# Altium schematic sheet PE0024.SchDoc
size 558 x 431 mm; SheetNumber: 1; SheetTotal: 1; SPICEModelCacheSWXRTNLW: <root> / <DocumentId>SWXRTNLW</DocumentId> / <CacheFrame Number="0"> / <Model Name="cap" Kind="MDL"> / <Text>*Default semiconductor capacitor / .MODEL CAP C()</Text> / </Model> / </CacheFrame> / </root>
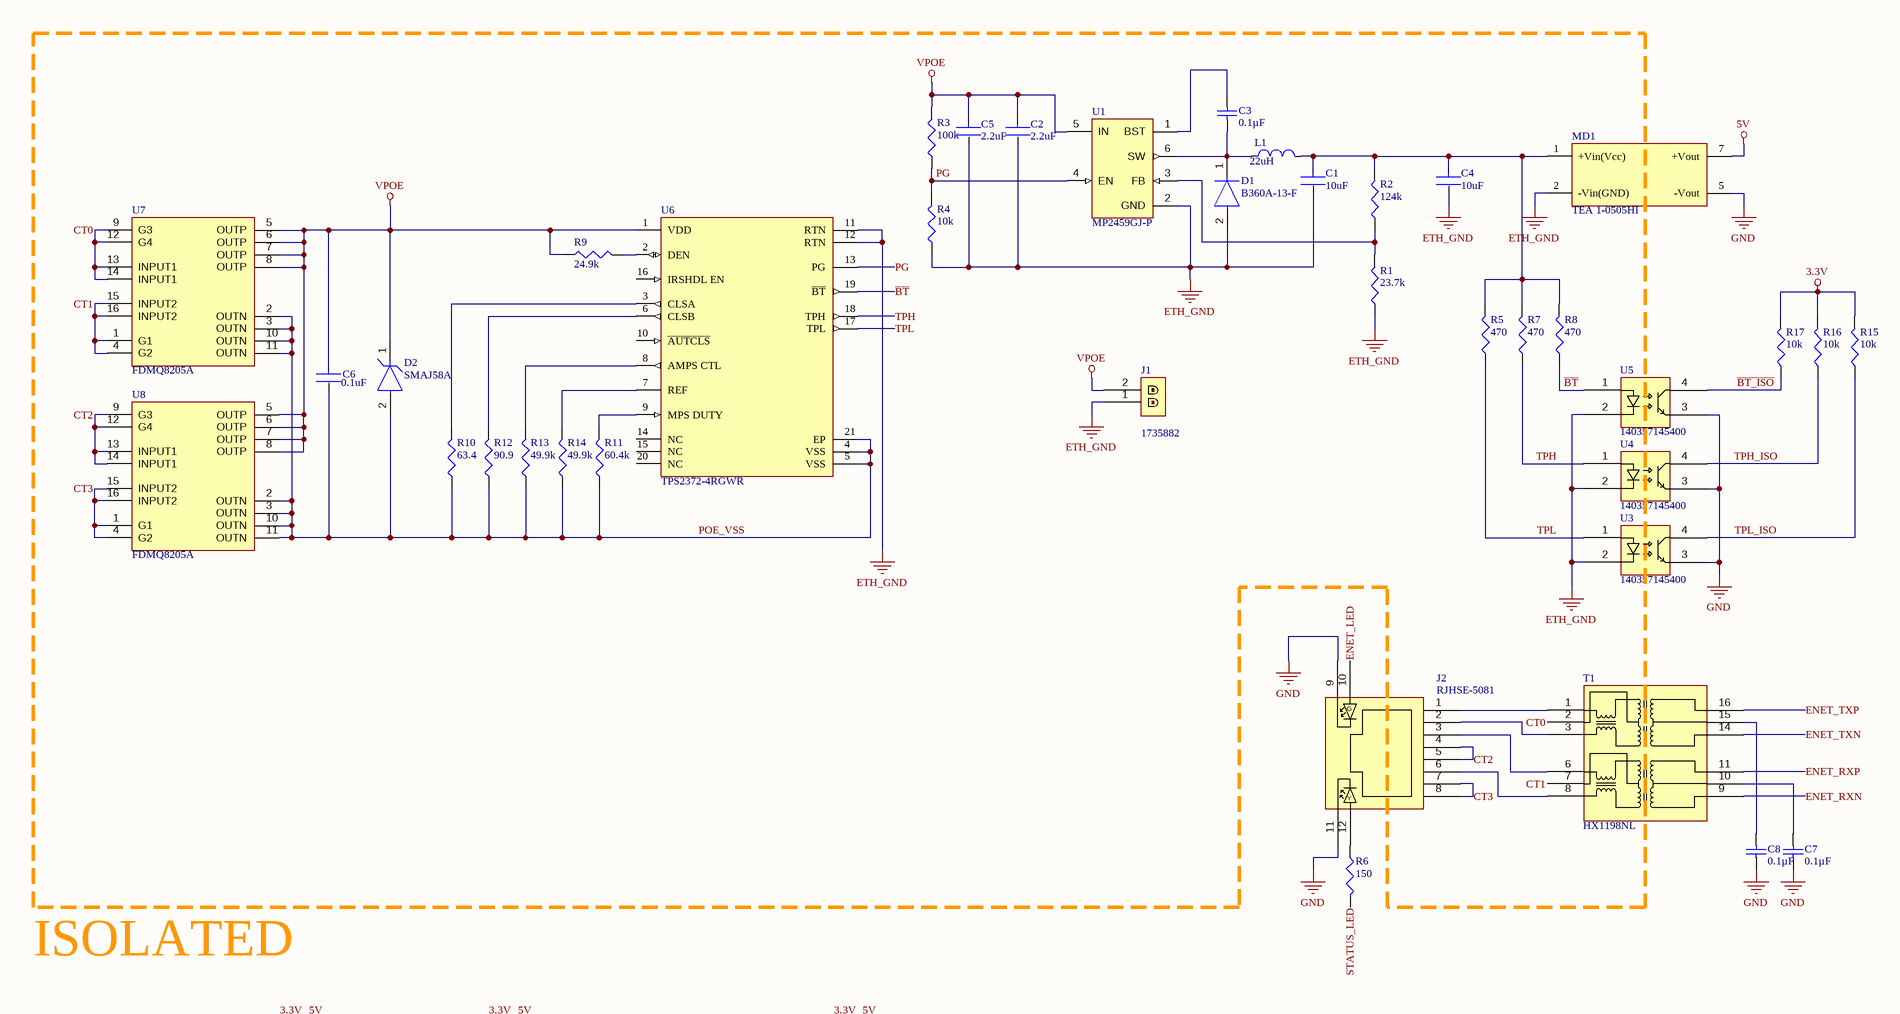
[diagram p0: PE0024.SchDoc, top left]
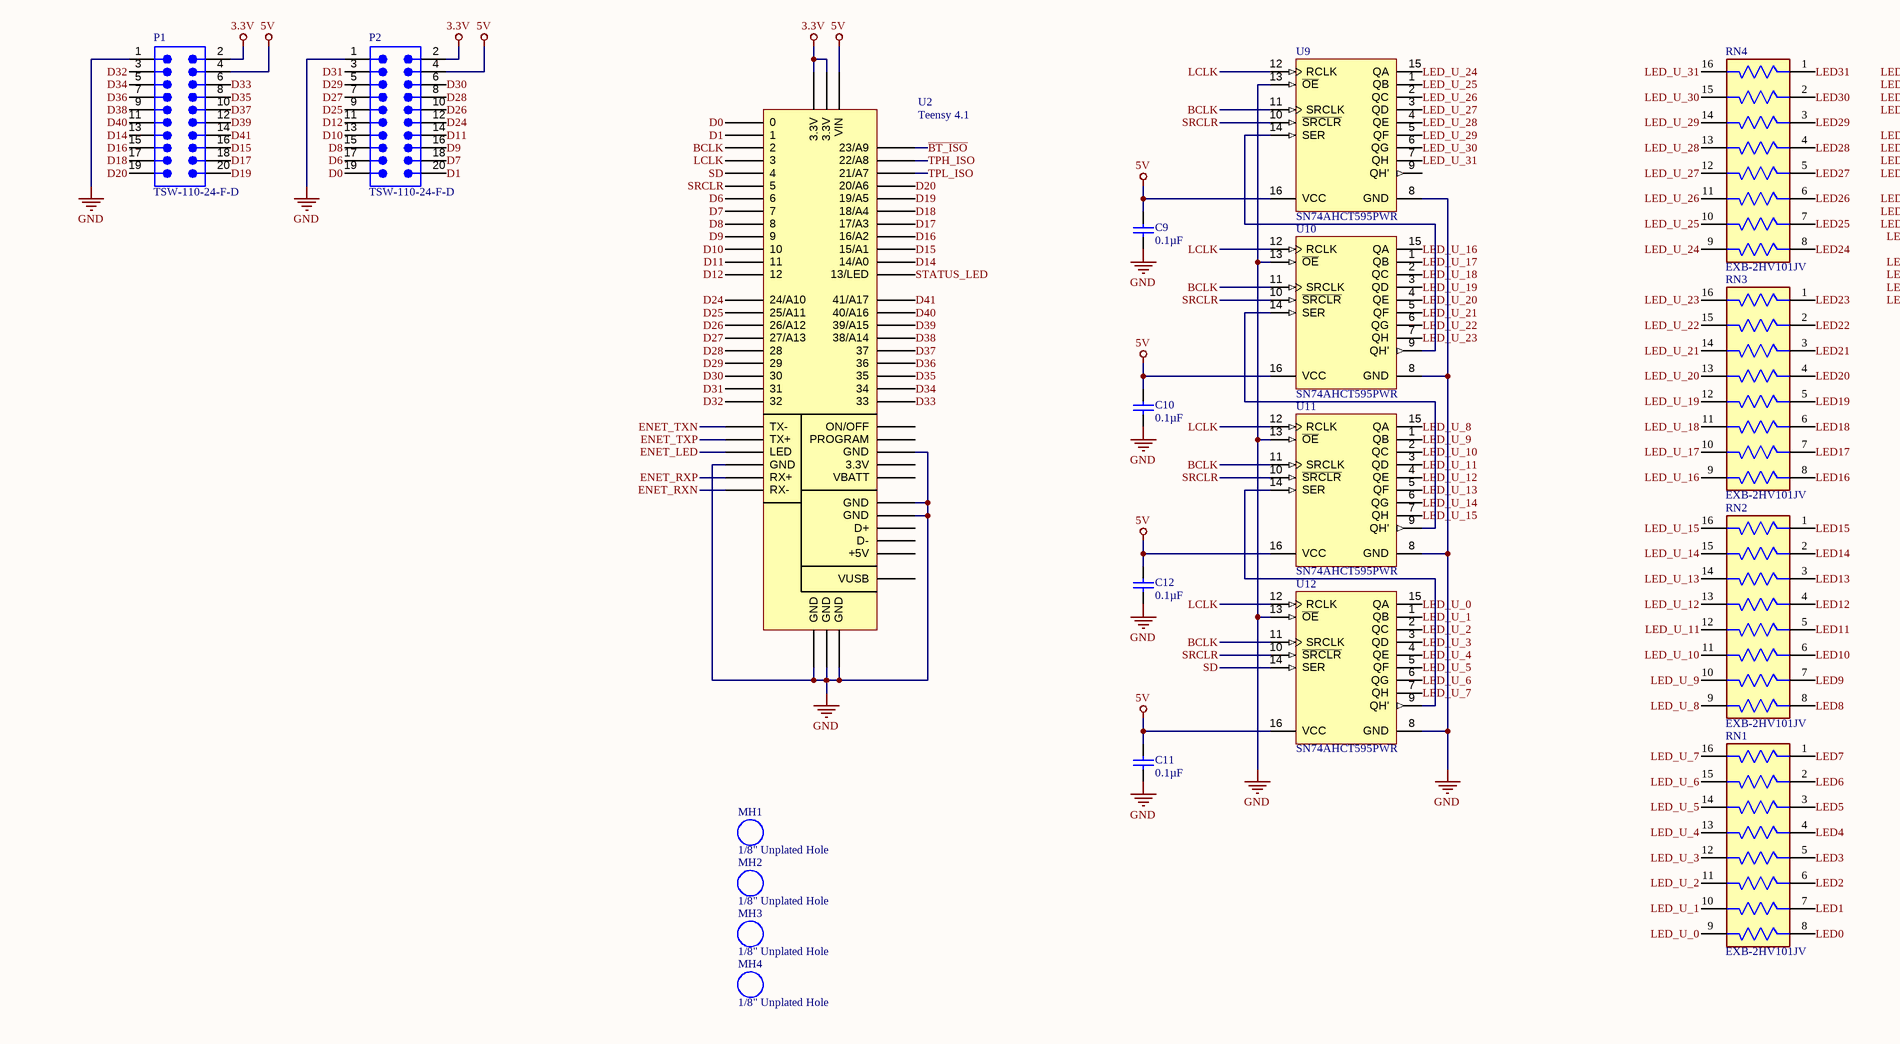
[diagram p1: PE0024.SchDoc, bottom left]
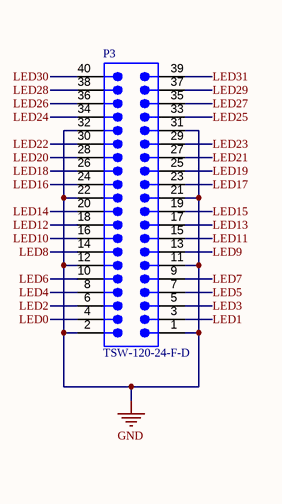
[diagram p2: PE0024.SchDoc, bottom right]

## Parts
C1  Capacitance: 10uF  [FP-GRM21B-0_1-IPC_C]  (hidden comment: GRM21BR61C106KE15L)
C2  Capacitance: 2.2uF  [FP-C3216-160-0_2-IPC_B]  (hidden comment: C3216X7S2A225K160AB)
C3  value 0.1µF  [0402CAP]  (hidden comment: Cap)
C4  Capacitance: 10uF  [FP-GRM21B-0_1-IPC_C]  (hidden comment: GRM21BR61C106KE15L)
C5  Capacitance: 2.2uF  [FP-C3216-160-0_2-IPC_B]  (hidden comment: C3216X7S2A225K160AB)
C6  Capacitance: 0.1uF  [FP-GRM188-0_1-e0_2_0_5-IPC_B]  (hidden comment: GRM188R72A104KA35D)
C7  value 0.1µF  [0402CAP]  (hidden comment: Cap)
C8  value 0.1µF  [0402CAP]  (hidden comment: Cap)
C9  value 0.1µF  [0402CAP]  (hidden comment: Cap)
C10  value 0.1µF  [0402CAP]  (hidden comment: Cap)
C11  value 0.1µF  [0402CAP]  (hidden comment: Cap)
C12  value 0.1µF  [0402CAP]  (hidden comment: Cap)
D1  B360A-13-F  [FP-SMA-MFG]
D2  SMAJ58A  [FP-SMAJ-MFG]
J1  1735882  [MSTBW 2,5/2-G-5,08]
J2  RJHSE-5081  [RJHSE-5081]
L1  Inductance: 22uH  [FP-NR6028-MFG]  (hidden comment: NRS6028T220MMGJ)
MD1  TEA 1-0505HI  [FP-TEA_1HI-MFG]
MH1  1/8" Unplated Hole  [1/8" Unplated Hole]
MH2  1/8" Unplated Hole  [1/8" Unplated Hole]
MH3  1/8" Unplated Hole  [1/8" Unplated Hole]
MH4  1/8" Unplated Hole  [1/8" Unplated Hole]
P1  TSW-110-24-F-D  [SMTC-TSW-110-24-X-D]
P2  TSW-110-24-F-D  [SMTC-TSW-110-24-X-D]
P3  TSW-120-24-F-D  [SMTC-TSW-120-24-X-D]
R1  value 23.7k  [0402RES]  (hidden comment: Res)
R2  value 124k  [0402RES]  (hidden comment: Res)
R3  value 100k  [0402RES]  (hidden comment: Res)
R4  value 10k  [0402RES]  (hidden comment: Res)
R5  value 470  [0402RES]  (hidden comment: Res)
R6  value 150  [0402RES]  (hidden comment: Res)
R7  value 470  [0402RES]  (hidden comment: Res)
R8  value 470  [0402RES]  (hidden comment: Res)
R9  value 24.9k  [0402RES]  (hidden comment: Res)
R10  value 63.4  [0402RES]  (hidden comment: Res)
R11  value 60.4k  [0402RES]  (hidden comment: Res)
R12  value 90.9  [0402RES]  (hidden comment: Res)
R13  value 49.9k  [0402RES]  (hidden comment: Res)
R14  value 49.9k  [0402RES]  (hidden comment: Res)
R15  value 10k  [0402RES]  (hidden comment: Res)
R16  value 10k  [0402RES]  (hidden comment: Res)
R17  value 10k  [0402RES]  (hidden comment: Res)
RN1  EXB-2HV101JV  [FP-EXB2HV-MFG]
RN2  EXB-2HV101JV  [FP-EXB2HV-MFG]
RN3  EXB-2HV101JV  [FP-EXB2HV-MFG]
RN4  EXB-2HV101JV  [FP-EXB2HV-MFG]
T1  HX1198NL  [HX1198NL]
U1  MP2459GJ-P  [FP-MP2459GJ-P-MFG]
U2  Teensy 4.1  [Teensy_4.1]
U3  140357145400  [SOP254P700X210-4N]
U4  140357145400  [SOP254P700X210-4N]
U5  140357145400  [SOP254P700X210-4N]
U6  TPS2372-4RGWR  [FP-RGW0020B-MFG]
U7  FDMQ8205A  [FP-511CS-MFG]
U8  FDMQ8205A  [FP-511CS-MFG]
U9  SN74AHCT595PWR  [PW0016A_M]
U10  SN74AHCT595PWR  [PW0016A_M]
U11  SN74AHCT595PWR  [PW0016A_M]
U12  SN74AHCT595PWR  [PW0016A_M]

## Nets
3.3V: P1.2 P2.2 R15.2 R16.2 R17.2 U2.15(3.3V) U2.46(3.3V)
5V: C9.2 C10.2 C11.2 C12.2 MD1.7(+Vout) P1.4 P2.4 U2.48(VIN) U9.16(VCC) U10.16(VCC) U11.16(VCC) U12.16(VCC)
ETH_GND: C1.2 C2.2 C4.2 C5.2 D1.2(A) J1.1 MD1.2(-Vin(GND)) R1.1 R4.1 U1.2(GND) U3.2 U4.2 U5.2 U6.11(RTN) U6.12(RTN)
GND: C7.1 C8.1 C9.1 C10.1 C11.1 C12.1 J2.9 J2.11 MD1.5(-Vout) P1.1 P2.1 P3.1 P3.2 P3.11 P3.12 P3.21 P3.22 P3.31 P3.32 U2.1(GND) U2.34(GND) U2.47(GND) U2.51(GND) U2.57(GND) U2.58(GND) U2.63(GND) U3.3 U4.3 U5.3 U9.8(GND) U9.13(~{OE}) U10.8(GND) U10.13(~{OE}) U11.8(GND) U11.13(~{OE}) U12.8(GND) U12.13(~{OE})
VPOE: C2.1 C5.1 C6.1 D2.1(C) J1.2 R3.2 R9.1 U1.5(IN) U6.1(VDD) U7.5(OUTP) U7.6(OUTP) U7.7(OUTP) U7.8(OUTP) U8.5(OUTP) U8.6(OUTP) U8.7(OUTP) U8.8(OUTP)
~{BT}: R8.1 U5.1 U6.19(~{BT})
~{BT_ISO}: R17.1 U2.45(23/A9) U5.4
BCLK: U2.4(2) U9.11(SRCLK) U10.11(SRCLK) U11.11(SRCLK) U12.11(SRCLK)
CT0: T1.2 U7.9(G3) U7.12(G4) U7.13(INPUT1) U7.14(INPUT1)
CT1: T1.7 U7.1(G1) U7.4(G2) U7.15(INPUT2) U7.16(INPUT2)
CT2: J2.4 J2.5 U8.9(G3) U8.12(G4) U8.13(INPUT1) U8.14(INPUT1)
CT3: J2.7 J2.8 U8.1(G1) U8.4(G2) U8.15(INPUT2) U8.16(INPUT2)
D0: P2.19 U2.2(0)
D1: P2.20 U2.3(1)
D6: P2.17 U2.8(6)
D7: P2.18 U2.9(7)
D8: P2.15 U2.10(8)
D9: P2.16 U2.11(9)
D10: P2.13 U2.12(10)
D11: P2.14 U2.13(11)
D12: P2.11 U2.14(12)
D14: P1.13 U2.36(14/A0)
D15: P1.16 U2.37(15/A1)
D16: P1.15 U2.38(16/A2)
D17: P1.18 U2.39(17/A3)
D18: P1.17 U2.40(18/A4)
D19: P1.20 U2.41(19/A5)
D20: P1.19 U2.42(20/A6)
D24: P2.12 U2.16(24/A10)
D25: P2.9 U2.17(25/A11)
D26: P2.10 U2.18(26/A12)
D27: P2.7 U2.19(27/A13)
D28: P2.8 U2.20(28)
D29: P2.5 U2.21(29)
D30: P2.6 U2.22(30)
D31: P2.3 U2.23(31)
D32: P1.3 U2.24(32)
D33: P1.6 U2.25(33)
D34: P1.5 U2.26(34)
D35: P1.8 U2.27(35)
D36: P1.7 U2.28(36)
D37: P1.10 U2.29(37)
D38: P1.9 U2.30(38/A14)
D39: P1.12 U2.31(39/A15)
D40: P1.11 U2.32(40/A16)
D41: P1.14 U2.33(41/A17)
ENET_LED: J2.10 U2.62(LED)
ENET_RXN: T1.9 U2.65(RX-)
ENET_RXP: T1.11 U2.64(RX+)
ENET_TXN: T1.14 U2.60(TX-)
ENET_TXP: T1.16 U2.61(TX+)
LCLK: U2.5(3) U9.12(RCLK) U10.12(RCLK) U11.12(RCLK) U12.12(RCLK)
LED0: P3.4 RN1.8
LED1: P3.3 RN1.7
LED2: P3.6 RN1.6
LED3: P3.5 RN1.5
LED4: P3.8 RN1.4
LED5: P3.7 RN1.3
LED6: P3.10 RN1.2
LED7: P3.9 RN1.1
LED8: P3.14 RN2.8
LED9: P3.13 RN2.7
LED10: P3.16 RN2.6
LED11: P3.15 RN2.5
LED12: P3.18 RN2.4
LED13: P3.17 RN2.3
LED14: P3.20 RN2.2
LED15: P3.19 RN2.1
LED16: P3.24 RN3.8
LED17: P3.23 RN3.7
LED18: P3.26 RN3.6
LED19: P3.25 RN3.5
LED20: P3.28 RN3.4
LED21: P3.27 RN3.3
LED22: P3.30 RN3.2
LED23: P3.29 RN3.1
LED24: P3.34 RN4.8
LED25: P3.33 RN4.7
LED26: P3.36 RN4.6
LED27: P3.35 RN4.5
LED28: P3.38 RN4.4
LED29: P3.37 RN4.3
LED30: P3.40 RN4.2
LED31: P3.39 RN4.1
LED_U_0: RN1.9 U12.15(QA)
LED_U_1: RN1.10 U12.1(QB)
LED_U_2: RN1.11 U12.2(QC)
LED_U_3: RN1.12 U12.3(QD)
LED_U_4: RN1.13 U12.4(QE)
LED_U_5: RN1.14 U12.5(QF)
LED_U_6: RN1.15 U12.6(QG)
LED_U_7: RN1.16 U12.7(QH)
LED_U_8: RN2.9 U11.15(QA)
LED_U_9: RN2.10 U11.1(QB)
LED_U_10: RN2.11 U11.2(QC)
LED_U_11: RN2.12 U11.3(QD)
LED_U_12: RN2.13 U11.4(QE)
LED_U_13: RN2.14 U11.5(QF)
LED_U_14: RN2.15 U11.6(QG)
LED_U_15: RN2.16 U11.7(QH)
LED_U_16: RN3.9 U10.15(QA)
LED_U_17: RN3.10 U10.1(QB)
LED_U_18: RN3.11 U10.2(QC)
LED_U_19: RN3.12 U10.3(QD)
LED_U_20: RN3.13 U10.4(QE)
LED_U_21: RN3.14 U10.5(QF)
LED_U_22: RN3.15 U10.6(QG)
LED_U_23: RN3.16 U10.7(QH)
LED_U_24: RN4.9 U9.15(QA)
LED_U_25: RN4.10 U9.1(QB)
LED_U_26: RN4.11 U9.2(QC)
LED_U_27: RN4.12 U9.3(QD)
LED_U_28: RN4.13 U9.4(QE)
LED_U_29: RN4.14 U9.5(QF)
LED_U_30: RN4.15 U9.6(QG)
LED_U_31: RN4.16 U9.7(QH)
PG: R3.1 R4.2 U1.4(EN) U6.13(PG)
POE_VSS: C6.2 D2.2(A) R10.1 R11.1 R12.1 R13.1 R14.1 U6.4(VSS) U6.5(VSS) U6.21(EP) U7.2(OUTN) U7.3(OUTN) U7.10(OUTN) U7.11(OUTN) U8.2(OUTN) U8.3(OUTN) U8.10(OUTN) U8.11(OUTN)
SD: U2.6(4) U12.14(SER)
SRCLR: U2.7(5) U9.10(~{SRCLR}) U10.10(~{SRCLR}) U11.10(~{SRCLR}) U12.10(~{SRCLR})
STATUS_LED: R6.2 U2.35(13/LED)
TPH: R7.1 U4.1 U6.18(TPH)
TPH_ISO: R16.1 U2.44(22/A8) U4.4
TPL: R5.1 U3.1 U6.17(TPL)
TPL_ISO: R15.1 U2.43(21/A7) U3.4
NetC1_1: C1.1 C4.1 L1.2 MD1.1(+Vin(Vcc)) R2.2 R5.2 R7.2 R8.2
NetC3_1: C3.1 D1.1(C) L1.1 U1.6(SW)
NetC3_2: C3.2 U1.1(BST)
NetC7_2: C7.2 T1.10
NetC8_2: C8.2 T1.15
NetJ2_1: J2.1 T1.1
NetJ2_2: J2.2 T1.3
NetJ2_3: J2.3 T1.6
NetJ2_6: J2.6 T1.8
NetJ2_12: J2.12 R6.1
NetR1_2: R1.2 R2.1 U1.3(FB)
NetR9_2: R9.2 U6.2(DEN)
NetR10_2: R10.2 U6.3(CLSA)
NetR11_2: R11.2 U6.9(MPS_DUTY)
NetR12_2: R12.2 U6.6(CLSB)
NetR13_2: R13.2 U6.8(AMPS_CTL)
NetR14_2: R14.2 U6.7(REF)
NetU9_14: U9.14(SER) U10.9(QH')
NetU10_14: U10.14(SER) U11.9(QH')
NetU11_14: U11.14(SER) U12.9(QH')

Not connected (* = marked no-connect by the designer): U2 49(VBATT) 50(3.3V) 52(PROGRAM) 53(ON/OFF) 54(+5V) 55(D-) 56(D+) 59(VUSB); U6 10(~{AUTCLS}) 14(NC) 15(NC) 16(IRSHDL_EN) 20(NC); U9 9(QH')

## Notes on the sheet
- ISOLATED
- DWG. NO.
- REV.
- SHT.
- REVISION
- DESCRIPTION
- DATE
- APPROVED
- THIS DOCUMENT AND THE DATA DISCLOSED HEREIN OR HEREWITH IS THE PROPERTY OF ALTIUM LIMITED AND MAY BE FREELY DISTRIBUTED IN WHOLE. NO RIGHTS ARE RESERVED OR EXPRESS OR IMPLIED WARANTEE GIVEN.
- ENG:
- DSN:
- APPROVALS
- PROJECT
- Ramsdell Design
- Services
- DOCUMENT REVISION:
- DESIGN ITEM:
- Ward@rds-or.com
- (503)806-2120
- 229 NW Bailey Ave.
- Hillsboro,OR 97124
- CHK:
- BOM:
- REFERENCE DOCUMENTS
- PROJECT REVISION:
- TITLE
- FAB DWG:
- PCB DWG:
- ASSY DWG:
- SCALE:
- SIZE
- C
- CAGE CODE
- FILE NAME
- DWG NO.
- SHEET
- OF
- REV
- (in symbol RJHSE-5081) G; Y

## Library data of the parts
C1 C4 = CMP-2007-03453-2: Chip Multilayer Ceramic Capacitors for General Purpose, 0805, 10uF, X5R, 15%, 10%, 16V; Radiation Hardening: No; Thickness: 0.053inch; Voltage Rating (DC): 16V; Lead Free: Lead Free; Package Quantity: 1; Width: 1.25mm; Case Code (Imperial): 0805; Depth: 1.25mm; Packaging: Tape and Reel; Dielectric: X5R; Max Operating Temperature: 85°C; Tolerance: 10%; Voltage Rating: 16V; Voltage: 16V; Height: 1.25mm; Case Code (Metric): 2012; Material: Ceramic; Mount: Surface Mount; Case/Package: 0805; REACH SVHC: No SVHC; Length: 2mm; Min Operating Temperature: -55°C; Termination: SMD/SMT
C2 C5 = CMP-08246-004303-1: Multilayer Ceramic Capacitors 2.2uF ±10% 100V X7S SMD 1206; Min Operating Temperature: -55°C; Tolerance: 10%; Number of Pins: 2; Case Code (Metric): 3216; REACH SVHC: No SVHC; Package Quantity: 1; Lead Free: Lead Free; Termination: SMD/SMT; Voltage Rating (DC): 100V; Voltage Rating: 100V; Case Code (Imperial): 1206; Dielectric: X7S; Height: 1.6mm; Packaging: Tape and Reel; Weight: 0.000571oz; Radiation Hardening: No; Mount: Surface Mount; Width: 0.063inch; Length: 3.2mm; Case/Package: 1206; Depth: 1.6mm; RoHS Compliant: Yes; Max Operating Temperature: 125°C; Series: C; Voltage: 100V; Resistor Type: Ceramic; Thickness: 0.071inch; Construction: Flat
C3 C7-C12 = CAP_MUR_GRM155C71H104JE19D: CAP CER 0.1UF 50V X7S 0402; Manufacturer: Murata Electronics; detailed_description: 0.1µF ±5% 50V Ceramic Capacitor X7S 0402 (1005 Metric); Tolerance: ±5%; Published: 8-Jun-2000; LatestRevisionDate: 17-Jul-2002; LatestRevisionNote: Re-released for DXP Platform.; PackageReference: RAD-0.3; Publisher: Altium Limited; PackageDescription: Radial Cap, Thru-Hole; 2 Leads; 0.3 in Pin Spacing; Part Number: CAP_MUR_GRM155C71H104JE19D; Part Type: Capacitor; Supplier 1: Digi-Key; Manufacturer Part Number: GRM155C71H104JE19D; Supplier Part Number 1: 490-17678-1-ND; manufacturer_page_url: https://www.digikey.com/en/supplier-centers/murata-electronics; ComponentLink1URL: https://www.digikey.com/product-detail/en/murata-electronics/GRM155C71H104JE19D/490-17678-1-ND/8323531; primary_datasheet: https://search.murata.co.jp/Ceramy/image/img/A01X/G101/ENG/GRM155C71H104JE19-01A.pdf; primary_photo: https://media.digikey.com/Renders/Murata%20Renders/0402-(1005-Metric)-0 55mm.jpg; Manufacturer1: Murata Electronics; Packaging: Cut Tape (CT); Part Status: Active; Capacitance: 0.1µF; Voltage - Rated: 50V; Operating Temperature: -55°C ~ 125°C; Temperature Coefficient: X7S; Ratings: -; Mounting Type: Surface Mount  MLCC; Package / Case: 0402 (1005 Metric); Size / Dimension: 0.039" L x 0.020" W (1.00mm x 0.50mm); Base Part Number: GRM155C71H; Features: -; Applications: General Purpose; Failure Rate: -; Height - Seated (Max): -; Thickness (Max): 0.022" (0.55mm); Lead Spacing: -; Lead Style: -
C6 = CMP-1035-02595-8: Chip Multilayer Ceramic Capacitors for General Purpose, 0603, 0.10uF, X7R, 15%, 10%, 100V; Voltage Rating (DC): 100V; Material: Ceramic; Packaging: Tape and Reel; Dielectric: X7R; Case Code (Imperial): 0603; Package Quantity: 1; Height: 0.8mm; Weight: 0.000222oz; Min Operating Temperature: -55°C; Depth: 0.8mm; Mount: Surface Mount; Thickness: 0.035inch; Voltage: 100V; REACH SVHC: No SVHC; Case/Package: 0603; Voltage Rating: 100V; Width: 0.8mm; Tolerance: 10%; Lead Free: Lead Free; Case Code (Metric): 1608; Radiation Hardening: No; Max Operating Temperature: 125°C; Termination: SMD/SMT; Length: 1.6mm
D1 = CMP-2000-05898-2: DIODE SCHOTTKY 60V 3A SMA; Max Forward Surge Current (Ifsm): 80A; Forward Voltage: 700mV; Peak Reverse Current: 500uA; Element Configuration: Single; Capacitance: 250pF; Polarity: Standard; REACH SVHC: No SVHC; Case/Package: SMA; Average Rectified Current: 3A; Radiation Hardening: No; Output Current: 3A; Termination: SMD/SMT; Max Repetitive Reverse Voltage (Vrrm): 60V; Height: 2.3mm; Voltage Rating (DC): 60V; Weight: 0.002258oz; Min Operating Temperature: -55°C; Max Reverse Voltage (DC): 60V; Packaging: Tape and Reel; Width: 2.92mm; Forward Current: 3A; Max Operating Temperature: 150°C; Length: 4.6mm; Number of Pins: 2; Mount: Surface Mount; Lead Free: Lead Free; Package Quantity: 5000; Contact Plating: Tin; Peak Non-Repetitive Surge Current: 80A; Current Rating: 3A
D2 = CMP-08607-000100-1: TVS DIODE 58V 93.6V DO214AC; Test Current: 1mA; Max Reverse Leakage Current: 1uA; Power Dissipation: 400W; Reverse Breakdown Voltage: 64.4V; Direction: Unidirectional; Current: 43A; Number of Unidirectional Channels: 1; Power Line Protection: No; Peak Pulse Current: 4.3A; Max Breakdown Voltage: 71.2V; Max Power Dissipation: 3.3W; Element Configuration: Single; Max Operating Temperature: 150°C; Length: 4.5mm; Composition: Zener; Min Operating Temperature: -65°C; Voltage: 58V; Clamping Voltage: 93.6V; Breakdown Voltage: 64.4V; Operating Supply Voltage: 58V; Lead Free: Lead Free; Leakage Current: 1uA; Reverse Standoff Voltage: 58V; Packaging: Tape and Reel; Min Breakdown Voltage: 64.4V; Termination: SMD/SMT; Mount: Surface Mount; Width: 2.79mm; Package Quantity: 5000; Polarity: Unidirectional; Number of Channels: 1; Number of Elements: 1; Number of Pins: 2; REACH SVHC: No SVHC; Height: 2.087mm; Peak Pulse Power: 400W; Voltage Rating (DC): 58V; Max Surge Current: 4.3A
J1 = 1735882: Pluggable Terminal Blocks 2 Pos 5.08mm pitch Through Hole Header; Manufacturer: Phoenix Contact; Current Rating: 12A; Voltage Rating: 250V; Number of Positions: 2; Number of Levels: 1; Current: 15A; Voltage: 300V; Connector Type: Plug; Approvals: UL,CSA,VDE,CB; Supplier 1: Mouser; Supplier Part Number 1: 651-1735882; RoHS: Yes; Category: Terminal Blocks; Stock 1: 249; Pricing 1: 1=1.28000, 10=1.25000, 25=1.21000, 50=1.16000, 100=1.06000, 250=0.98500, 500=0.93900, 1000=0.88100, 2500=0.83600, 10000=0.83600 (USD); Mount: Through Hole; Contact Plating: Tin; Color: Green,Grey; Weight: 5.396916oz; Housing Color: Green; Housing Material: Polybutylene; Contact Material: Tin; Package Quantity: 1; Packaging: Bulk; Number of Positions Per Level: 2; Termination: Solder; Series: MSTBW; Number of Rows: 1; Max Current Rating: 12A; Orientation: Right Angle; Number of Contacts: 2; Number of Poles: 2; Length: 5.08mm; Width: 15.95mm; Height: 12mm; Pitch: 5.08mm; Depth: 12mm; Flammability Rating: UL94 V-0; Lead Free: Lead Free; ComponentLink1URL: https://datasheet.ciiva.com/15056/1735882-15056531.pdf?src-supplier=Digi-Key; ComponentLink1Description: https://datasheet.ciiva.com/15056/1735882-15056531.pdf?src-supplier=Digi-Key; ComponentLink2URL: https://datasheet.ciiva.com/15197/getdatasheetpartid-486383-15197280.pdf?src-supplier=Verical; ComponentLink2Description: https://datasheet.ciiva.com/15197/getdatasheetpartid-486383-15197280.pdf?src-supplier=Verical; ComponentLink3URL: https://datasheet.ciiva.com/29208/567275-da-01-de-grundgehaeuse-1735882-50-st-29208541.pdf?src-supplier=Conrad; ComponentLink3Description: https://datasheet.ciiva.com/29208/567275-da-01-de-grundgehaeuse-1735882-50-st-29208541.pdf?src-supplier=Conrad; ComponentLink4URL: https://datasheet.ciiva.com/815/1735882-815927.pdf?src-supplier=Digi-Key; ComponentLink4Description: https://datasheet.ciiva.com/815/1735882-815927.pdf?src-supplier=Digi-Key; Manufacturer Part Number: 1735882
J2 = RJHSE-5081: Modular Jack - Right Angle, Input Output Connectors 8P8C, RA, Without Shield, With LEDs.; Manufacturer: Amphenol; Shielding: Unshielded; Connector Type: Jack,RJ45; Number of Ports: 1; Direction: Up; Max Current Rating: 1.5A; Contact Resistance: 20mR; Gender: Female; Voltage Rating: 125V; Number of Positions Loaded: 8; Pitch: 2.03mm; Supplier 1: Digi-Key; Supplier Part Number 1: RJHSE-5081-ND; RoHS: Yes; Category: Modular / Ethernet Connectors; Mount: Through Hole; Contact Plating: Gold; Contact Material: Bronze; Color: Green,Yellow,Black; Housing Material: Thermoplastic; Min Operating Temperature: -55°C; Max Operating Temperature: 85°C; Packaging: Tray; Number of Rows: 1; Termination: Solder; Series: RJHSE; Current Rating: 1.5A; Max Voltage Rating (AC): 125V; Number of Contacts: 8; Orientation: Right Angle; Package Quantity: 36; Number of Positions: 8; Primary Type: MODULAR; Length: 15.75mm; Depth: 14.99mm; Radiation Hardening: No; Flammability Rating: UL94 V-0; RoHS Compliant: Yes; REACH SVHC: Unknown; ComponentLink1URL: https://datasheet.ciiva.com/14118/04248001-14118880.pdf?src-supplier=Distrelec; ComponentLink1Description: https://datasheet.ciiva.com/14118/04248001-14118880.pdf?src-supplier=Distrelec; ComponentLink2URL: https://datasheet.ciiva.com/26945/getdatasheetpartid-791870-26945348.pdf?src-supplier=Verical; ComponentLink2Description: https://datasheet.ciiva.com/26945/getdatasheetpartid-791870-26945348.pdf?src-supplier=Verical; ComponentLink3URL: https://datasheet.ciiva.com/686/rjhse508x-686948.pdf?src-supplier=Digi-Key; ComponentLink3Description: https://datasheet.ciiva.com/686/rjhse508x-686948.pdf?src-supplier=Digi-Key; ComponentLink4URL: https://datasheet.ciiva.com/18449/70115884-18449541.pdf?src-supplier=Allied+Electronics; ComponentLink4Description: https://datasheet.ciiva.com/18449/70115884-18449541.pdf?src-supplier=Allied+Electronics; Manufacturer Part Number: RJHSE-5081
L1 = CMP-14484-000617-1: SMD Power Inductors 22uH ±20% 1.3A 0.1755Ω; Shielding: Shielded; Self Resonant Frequency: 12MHz; Core Material: Ferrite; RMS Current (Irms): 1.4A; DC Resistance (DCR): 175.5mR; Test Frequency: 100kHz; Package Quantity: 2000; Resistor Type: Wirewound; Depth: 6.2mm; RoHS Compliant: Yes; Mount: Surface Mount; Min Operating Temperature: -25°C; Height: 2.8mm; Case/Package: Nonstandard; Max DC Current: 1.4A; Lead Free: Lead Free; Radiation Hardening: No; Halogen Free: Halogen Free; Inductance Tolerance: 20%; Current Rating: 1.4A; Width: 0.236inch; Packaging: Tape and Reel; Lead Pitch: 4.7mm; Tolerance: 20%; Series: NRS; Number of Pins: 2; Length: 6mm; Saturation Current: 1.3A; Height - Seated (Max): 0.11inch; Termination: SMD/SMT; Max Operating Temperature: 125°C
MD1 = CMP-49942-000020-1: DC DC CONVERTER 5V 1W; Isolation Voltage: 4kV; Max Input Voltage: 5.5V; Efficiency: 78%; Min Input Voltage: 4.5V; Max Output Current: 200mA; Number of Outputs: 1; Min Operating Temperature: -40°C; Voltage - Output 1: 5V; Max Operating Temperature: 95°C; Max Power Dissipation: 1W; Mount: Through Hole; Series: TEA 1HI (1W)
P1 P2 = CMP-1024-00453-1: 0.025" SQ Post Header, Through-hole, Vertical, -55 to 125 degC, 2.54 mm Pitch, 20-Pin, Male, RoHS; Manufacturer: Samtec; Pitch: 2.54 mm; ComponentLink2Description: Datasheet; Temperature Range: -55 to 125 degC; RoHS: True; ComponentLink1Description: Manufacturer URL; PackageReference: TSW-110-24-X-D; ComponentLink1URL: http://www.samtec.com; PartNumber: TSW-110-24-F-D; ComponentLink3Description: Package Specification; DatasheetVersion: F-214; PackageDescription: .025[0.64] SQ. Post Terminal Strip Assembly; Mounting Technology: Through-hole; Orientation: Vertical; PackageVersion: DM, 8/1988; ComponentLink3URL: http://www.samtec.com/documents/webfiles/cpdf/TSW-XXX-XX-XXX-X-XX-XXX-MKT.pdf; ComponentLink2URL: http://www.samtec.com/documents/webfiles/pdf/TSW_TH.PDF
P3 = CMP-1024-00453-1: 0.025" SQ Post Header, Through-hole, Vertical, -55 to 125 degC, 2.54 mm Pitch, 40-Pin, Male, RoHS; Manufacturer: Samtec; Pitch: 2.54 mm; ComponentLink2Description: Datasheet; Temperature Range: -55 to 125 degC; RoHS: True; ComponentLink1Description: Manufacturer URL; PackageReference: TSW-120-24-X-D; ComponentLink1URL: http://www.samtec.com; PartNumber: TSW-120-24-F-D; ComponentLink3Description: Package Specification; DatasheetVersion: F-214; PackageDescription: .025[0.64] SQ. Post Terminal Strip Assembly; Mounting Technology: Through-hole; Orientation: Vertical; PackageVersion: DM, 8/1988; ComponentLink3URL: http://www.samtec.com/documents/webfiles/cpdf/TSW-XXX-XX-XXX-X-XX-XXX-MKT.pdf; ComponentLink2URL: http://www.samtec.com/documents/webfiles/pdf/TSW_TH.PDF
R1 = RES_PAN_ERJ-2RKF2372X: RES SMD 23.7K OHM 1% 1/10W 0402; Manufacturer: Panasonic Electronic Components; detailed_description: 23.7 kOhms ±1% 0.1W  1/10W Chip Resistor 0402 (1005 Metric) Automotive AEC-Q200 Thick Film; Resistance: 23.7 kOhms; Power (Watts): 0.1W  1/10W; Temperature Coefficient: ±100ppm/°C; Published: 8-Jun-2000; LatestRevisionDate: 29-May-2009; LatestRevisionNote: IPC-7351 Footprint Added.; PackageReference: J1-0603; Publisher: Altium Limited; PackageDescription: Chip Resistor; Part Number: RES_PAN_ERJ-2RKF2372X; Part Type: Resistor; Supplier 1: Digi-Key; Manufacturer Part Number: ERJ-2RKF2372X; Supplier Part Number 1: P23.7KLCT-ND; manufacturer_page_url: https://www.digikey.com/en/supplier-centers/panasonic; ComponentLink1URL: https://www.digikey.com/product-detail/en/panasonic-electronic-components/ERJ-2RKF2372X/P23.7KLCT-ND/194277; primary_datasheet: https://industrial.panasonic.com/cdbs/www-data/pdf/RDA0000/AOA0000C304.pdf; primary_photo: https://media.digikey.com/photos/Panasonic%20Photos/10-0402.jpg; Packaging: Cut Tape (CT); Part Status: Active; Tolerance: ±1%; Composition: Thick Film; Features: Automotive AEC-Q200; Operating Temperature: -55°C ~ 155°C; Package / Case: 0402 (1005 Metric); Ratings: AEC-Q200; Supplier Device Package: 402; Size / Dimension: 0.039" L x 0.020" W (1.00mm x 0.50mm); Height - Seated (Max): 0.016" (0.40mm); Number of Terminations: 2; Failure Rate: -
R2 = RES_PAN_ERJ-2RKF1243X: RES SMD 124K OHM 1% 1/10W 0402; Manufacturer: Panasonic Electronic Components; detailed_description: 124 kOhms ±1% 0.1W  1/10W Chip Resistor 0402 (1005 Metric) Automotive AEC-Q200 Thick Film; Resistance: 124 kOhms; Power (Watts): 0.1W  1/10W; Temperature Coefficient: ±100ppm/°C; Published: 8-Jun-2000; LatestRevisionDate: 29-May-2009; LatestRevisionNote: IPC-7351 Footprint Added.; PackageReference: J1-0603; Publisher: Altium Limited; PackageDescription: Chip Resistor; Part Number: RES_PAN_ERJ-2RKF1243X; Part Type: Resistor; Supplier 1: Digi-Key; Manufacturer Part Number: ERJ-2RKF1243X; Supplier Part Number 1: P124KLCT-ND; manufacturer_page_url: https://www.digikey.com/en/supplier-centers/panasonic; ComponentLink1URL: https://www.digikey.com/product-detail/en/panasonic-electronic-components/ERJ-2RKF1243X/P124KLCT-ND/194159; primary_datasheet: https://industrial.panasonic.com/cdbs/www-data/pdf/RDA0000/AOA0000C304.pdf; primary_photo: https://media.digikey.com/photos/Panasonic%20Photos/10-0402.jpg; Packaging: Cut Tape (CT); Part Status: Active; Tolerance: ±1%; Composition: Thick Film; Features: Automotive AEC-Q200; Operating Temperature: -55°C ~ 155°C; Package / Case: 0402 (1005 Metric); Ratings: AEC-Q200; Supplier Device Package: 402; Size / Dimension: 0.039" L x 0.020" W (1.00mm x 0.50mm); Height - Seated (Max): 0.016" (0.40mm); Number of Terminations: 2; Failure Rate: -
R3 = RES_PAN_ERJ-2RKF1003X: RES SMD 100K OHM 1% 1/10W 0402; Manufacturer: Panasonic Electronic Components; detailed_description: 100 kOhms ±1% 0.1W  1/10W Chip Resistor 0402 (1005 Metric) Automotive AEC-Q200 Thick Film; Resistance: 100 kOhms; Power (Watts): 0.1W  1/10W; Temperature Coefficient: ±100ppm/°C; Published: 8-Jun-2000; LatestRevisionDate: 29-May-2009; LatestRevisionNote: IPC-7351 Footprint Added.; PackageReference: J1-0603; Publisher: Altium Limited; PackageDescription: Chip Resistor; Part Number: RES_PAN_ERJ-2RKF1003X; Part Type: Resistor; Supplier 1: Digi-Key; Manufacturer Part Number: ERJ-2RKF1003X; Supplier Part Number 1: P100KLCT-ND; manufacturer_page_url: https://www.digikey.com/en/supplier-centers/panasonic; ComponentLink1URL: https://www.digikey.com/product-detail/en/panasonic-electronic-components/ERJ-2RKF1003X/P100KLCT-ND/194127; primary_datasheet: https://industrial.panasonic.com/cdbs/www-data/pdf/RDA0000/AOA0000C304.pdf; primary_photo: https://media.digikey.com/photos/Panasonic%20Photos/10-0402.jpg; Packaging: Cut Tape (CT); Part Status: Active; Tolerance: ±1%; Composition: Thick Film; Features: Automotive AEC-Q200; Operating Temperature: -55°C ~ 155°C; Package / Case: 0402 (1005 Metric); Ratings: AEC-Q200; Supplier Device Package: 402; Size / Dimension: 0.039" L x 0.020" W (1.00mm x 0.50mm); Height - Seated (Max): 0.016" (0.40mm); Number of Terminations: 2; Failure Rate: -
R4 R15-R17 = RES_PAN_ERJ-2RKF1002X: RES SMD 10K OHM 1% 1/10W 0402; Manufacturer: Panasonic Electronic Components; detailed_description: 10 kOhms ±1% 0.1W  1/10W Chip Resistor 0402 (1005 Metric) Automotive AEC-Q200 Thick Film; Resistance: 10 kOhms; Power (Watts): 0.1W  1/10W; Temperature Coefficient: ±100ppm/°C; Published: 8-Jun-2000; LatestRevisionDate: 29-May-2009; LatestRevisionNote: IPC-7351 Footprint Added.; PackageReference: J1-0603; Publisher: Altium Limited; PackageDescription: Chip Resistor; Part Number: RES_PAN_ERJ-2RKF1002X; Part Type: Resistor; Supplier 1: Digi-Key; Manufacturer Part Number: ERJ-2RKF1002X; Supplier Part Number 1: P10.0KLCT-ND; manufacturer_page_url: https://www.digikey.com/en/supplier-centers/panasonic; ComponentLink1URL: https://www.digikey.com/product-detail/en/panasonic-electronic-components/ERJ-2RKF1002X/P10.0KLCT-ND/194119; primary_datasheet: https://industrial.panasonic.com/cdbs/www-data/pdf/RDA0000/AOA0000C304.pdf; primary_photo: https://media.digikey.com/photos/Panasonic%20Photos/10-0402.jpg; Packaging: Cut Tape (CT); Part Status: Active; Tolerance: ±1%; Composition: Thick Film; Features: Automotive AEC-Q200; Operating Temperature: -55°C ~ 155°C; Package / Case: 0402 (1005 Metric); Ratings: AEC-Q200; Supplier Device Package: 402; Size / Dimension: 0.039" L x 0.020" W (1.00mm x 0.50mm); Height - Seated (Max): 0.016" (0.40mm); Number of Terminations: 2; Failure Rate: -
R5 R7 R8 = RES_PAN_ERJ-2RKF4700X: RES SMD 470 OHM 1% 1/10W 0402; Manufacturer: Panasonic Electronic Components; detailed_description: 470 Ohms ±1% 0.1W  1/10W Chip Resistor 0402 (1005 Metric) Automotive AEC-Q200 Thick Film; Resistance: 470 Ohms; Power (Watts): 0.1W  1/10W; Temperature Coefficient: ±100ppm/°C; Published: 8-Jun-2000; LatestRevisionDate: 29-May-2009; LatestRevisionNote: IPC-7351 Footprint Added.; PackageReference: J1-0603; Publisher: Altium Limited; PackageDescription: Chip Resistor; Part Number: RES_PAN_ERJ-2RKF4700X; Part Type: Resistor; Supplier 1: Digi-Key; Manufacturer Part Number: ERJ-2RKF4700X; Supplier Part Number 1: P470LCT-ND; manufacturer_page_url: https://www.digikey.com/en/supplier-centers/panasonic; ComponentLink1URL: https://www.digikey.com/product-detail/en/panasonic-electronic-components/ERJ-2RKF4700X/P470LCT-ND/1746691; primary_datasheet: https://industrial.panasonic.com/cdbs/www-data/pdf/RDA0000/AOA0000C304.pdf; primary_photo: https://media.digikey.com/photos/Panasonic%20Photos/10-0402.jpg; Packaging: Cut Tape (CT); Part Status: Active; Tolerance: ±1%; Composition: Thick Film; Features: Automotive AEC-Q200; Operating Temperature: -55°C ~ 155°C; Package / Case: 0402 (1005 Metric); Ratings: AEC-Q200; Supplier Device Package: 402; Size / Dimension: 0.039" L x 0.020" W (1.00mm x 0.50mm); Height - Seated (Max): 0.016" (0.40mm); Number of Terminations: 2; Failure Rate: -
R6 = RES_PAN_ERJ-2RKF1500X: RES SMD 150 OHM 1% 1/10W 0402; Manufacturer: Panasonic Electronic Components; detailed_description: 150 Ohms ±1% 0.1W  1/10W Chip Resistor 0402 (1005 Metric) Automotive AEC-Q200 Thick Film; Resistance: 150 Ohms; Power (Watts): 0.1W  1/10W; Temperature Coefficient: ±100ppm/°C; Published: 8-Jun-2000; LatestRevisionDate: 29-May-2009; LatestRevisionNote: IPC-7351 Footprint Added.; PackageReference: J1-0603; Publisher: Altium Limited; PackageDescription: Chip Resistor; Part Number: RES_PAN_ERJ-2RKF1500X; Part Type: Resistor; Supplier 1: Digi-Key; Manufacturer Part Number: ERJ-2RKF1500X; Supplier Part Number 1: P150LCT-ND; manufacturer_page_url: https://www.digikey.com/en/supplier-centers/panasonic; ComponentLink1URL: https://www.digikey.com/product-detail/en/panasonic-electronic-components/ERJ-2RKF1500X/P150LCT-ND/194191; primary_datasheet: https://industrial.panasonic.com/cdbs/www-data/pdf/RDA0000/AOA0000C304.pdf; primary_photo: https://media.digikey.com/photos/Panasonic%20Photos/10-0402.jpg; Packaging: Cut Tape (CT); Part Status: Active; Tolerance: ±1%; Composition: Thick Film; Features: Automotive AEC-Q200; Operating Temperature: -55°C ~ 155°C; Package / Case: 0402 (1005 Metric); Ratings: AEC-Q200; Supplier Device Package: 402; Size / Dimension: 0.039" L x 0.020" W (1.00mm x 0.50mm); Height - Seated (Max): 0.016" (0.40mm); Number of Terminations: 2; Failure Rate: -
R9 = RES_PAN_ERJ-2RKF2492X: RES SMD 24.9K OHM 1% 1/10W 0402; Manufacturer: Panasonic Electronic Components; detailed_description: 24.9 kOhms ±1% 0.1W  1/10W Chip Resistor 0402 (1005 Metric) Automotive AEC-Q200 Thick Film; Resistance: 24.9 kOhms; Power (Watts): 0.1W  1/10W; Temperature Coefficient: ±100ppm/°C; Published: 8-Jun-2000; LatestRevisionDate: 29-May-2009; LatestRevisionNote: IPC-7351 Footprint Added.; PackageReference: J1-0603; Publisher: Altium Limited; PackageDescription: Chip Resistor; Part Number: RES_PAN_ERJ-2RKF2492X; Part Type: Resistor; Supplier 1: Digi-Key; Manufacturer Part Number: ERJ-2RKF2492X; Supplier Part Number 1: P24.9KLCT-ND; manufacturer_page_url: https://www.digikey.com/en/supplier-centers/panasonic; ComponentLink1URL: https://www.digikey.com/product-detail/en/panasonic-electronic-components/ERJ-2RKF2492X/P24.9KLCT-ND/194285; primary_datasheet: https://industrial.panasonic.com/cdbs/www-data/pdf/RDA0000/AOA0000C304.pdf; primary_photo: https://media.digikey.com/photos/Panasonic%20Photos/10-0402.jpg; Packaging: Cut Tape (CT); Part Status: Active; Tolerance: ±1%; Composition: Thick Film; Features: Automotive AEC-Q200; Operating Temperature: -55°C ~ 155°C; Package / Case: 0402 (1005 Metric); Ratings: AEC-Q200; Supplier Device Package: 402; Size / Dimension: 0.039" L x 0.020" W (1.00mm x 0.50mm); Height - Seated (Max): 0.016" (0.40mm); Number of Terminations: 2; Failure Rate: -
R10 = RES_PAN_ERJ-2RKF63R4X: RES SMD 63.4 OHM 1% 1/10W 0402; Manufacturer: Panasonic Electronic Components; detailed_description: 63.4 Ohms ±1% 0.1W  1/10W Chip Resistor 0402 (1005 Metric) Automotive AEC-Q200 Thick Film; Resistance: 63.4 Ohms; Power (Watts): 0.1W  1/10W; Temperature Coefficient: ±100ppm/°C; Published: 8-Jun-2000; LatestRevisionDate: 29-May-2009; LatestRevisionNote: IPC-7351 Footprint Added.; PackageReference: J1-0603; Publisher: Altium Limited; PackageDescription: Chip Resistor; Part Number: RES_PAN_ERJ-2RKF63R4X; Part Type: Resistor; Supplier 1: Digi-Key; Manufacturer Part Number: ERJ-2RKF63R4X; Supplier Part Number 1: P63.4LCT-ND; manufacturer_page_url: https://www.digikey.com/en/supplier-centers/panasonic; ComponentLink1URL: https://www.digikey.com/product-detail/en/panasonic-electronic-components/ERJ-2RKF63R4X/P63.4LCT-ND/194480; primary_datasheet: https://industrial.panasonic.com/cdbs/www-data/pdf/RDA0000/AOA0000C304.pdf; primary_photo: https://media.digikey.com/photos/Panasonic%20Photos/10-0402.jpg; Packaging: Cut Tape (CT); Part Status: Active; Tolerance: ±1%; Composition: Thick Film; Features: Automotive AEC-Q200; Operating Temperature: -55°C ~ 155°C; Package / Case: 0402 (1005 Metric); Ratings: AEC-Q200; Supplier Device Package: 402; Size / Dimension: 0.039" L x 0.020" W (1.00mm x 0.50mm); Height - Seated (Max): 0.016" (0.40mm); Number of Terminations: 2; Failure Rate: -
R11 = RES_PAN_ERJ-2RKF6042X: RES SMD 60.4K OHM 1% 1/10W 0402; Manufacturer: Panasonic Electronic Components; detailed_description: 60.4 kOhms ±1% 0.1W  1/10W Chip Resistor 0402 (1005 Metric) Automotive AEC-Q200 Thick Film; Resistance: 60.4 kOhms; Power (Watts): 0.1W  1/10W; Temperature Coefficient: ±100ppm/°C; Published: 8-Jun-2000; LatestRevisionDate: 29-May-2009; LatestRevisionNote: IPC-7351 Footprint Added.; PackageReference: J1-0603; Publisher: Altium Limited; PackageDescription: Chip Resistor; Part Number: RES_PAN_ERJ-2RKF6042X; Part Type: Resistor; Supplier 1: Digi-Key; Manufacturer Part Number: ERJ-2RKF6042X; Supplier Part Number 1: P60.4KLCT-ND; manufacturer_page_url: https://www.digikey.com/en/supplier-centers/panasonic; ComponentLink1URL: https://www.digikey.com/product-detail/en/panasonic-electronic-components/ERJ-2RKF6042X/P60.4KLCT-ND/194473; primary_datasheet: https://industrial.panasonic.com/cdbs/www-data/pdf/RDA0000/AOA0000C304.pdf; primary_photo: https://media.digikey.com/photos/Panasonic%20Photos/10-0402.jpg; Packaging: Cut Tape (CT); Part Status: Active; Tolerance: ±1%; Composition: Thick Film; Features: Automotive AEC-Q200; Operating Temperature: -55°C ~ 155°C; Package / Case: 0402 (1005 Metric); Ratings: AEC-Q200; Supplier Device Package: 402; Size / Dimension: 0.039" L x 0.020" W (1.00mm x 0.50mm); Height - Seated (Max): 0.016" (0.40mm); Number of Terminations: 2; Failure Rate: -
R12 = RES_PAN_ERJ-2RKF90R9X: RES SMD 90.9 OHM 1% 1/10W 0402; Manufacturer: Panasonic Electronic Components; detailed_description: 90.9 Ohms ±1% 0.1W  1/10W Chip Resistor 0402 (1005 Metric) Automotive AEC-Q200 Thick Film; Resistance: 90.9 Ohms; Power (Watts): 0.1W  1/10W; Temperature Coefficient: ±100ppm/°C; Published: 8-Jun-2000; LatestRevisionDate: 29-May-2009; LatestRevisionNote: IPC-7351 Footprint Added.; PackageReference: J1-0603; Publisher: Altium Limited; PackageDescription: Chip Resistor; Part Number: RES_PAN_ERJ-2RKF90R9X; Part Type: Resistor; Supplier 1: Digi-Key; Manufacturer Part Number: ERJ-2RKF90R9X; Supplier Part Number 1: P90.9LCT-ND; manufacturer_page_url: https://www.digikey.com/en/supplier-centers/panasonic; ComponentLink1URL: https://www.digikey.com/product-detail/en/panasonic-electronic-components/ERJ-2RKF90R9X/P90.9LCT-ND/194555; primary_datasheet: https://industrial.panasonic.com/cdbs/www-data/pdf/RDA0000/AOA0000C304.pdf; primary_photo: https://media.digikey.com/photos/Panasonic%20Photos/10-0402.jpg; Packaging: Cut Tape (CT); Part Status: Active; Tolerance: ±1%; Composition: Thick Film; Features: Automotive AEC-Q200; Operating Temperature: -55°C ~ 155°C; Package / Case: 0402 (1005 Metric); Ratings: AEC-Q200; Supplier Device Package: 402; Size / Dimension: 0.039" L x 0.020" W (1.00mm x 0.50mm); Height - Seated (Max): 0.016" (0.40mm); Number of Terminations: 2; Failure Rate: -
R13 R14 = RES_PAN_ERJ-2RKF4992X: RES SMD 49.9K OHM 1% 1/10W 0402; Manufacturer: Panasonic Electronic Components; detailed_description: 49.9 kOhms ±1% 0.1W  1/10W Chip Resistor 0402 (1005 Metric) Automotive AEC-Q200 Thick Film; Resistance: 49.9 kOhms; Power (Watts): 0.1W  1/10W; Temperature Coefficient: ±100ppm/°C; Published: 8-Jun-2000; LatestRevisionDate: 29-May-2009; LatestRevisionNote: IPC-7351 Footprint Added.; PackageReference: J1-0603; Publisher: Altium Limited; PackageDescription: Chip Resistor; Part Number: RES_PAN_ERJ-2RKF4992X; Part Type: Resistor; Supplier 1: Digi-Key; Manufacturer Part Number: ERJ-2RKF4992X; Supplier Part Number 1: P49.9KLCT-ND; manufacturer_page_url: https://www.digikey.com/en/supplier-centers/panasonic; ComponentLink1URL: https://www.digikey.com/product-detail/en/panasonic-electronic-components/ERJ-2RKF4992X/P49.9KLCT-ND/194427; primary_datasheet: https://industrial.panasonic.com/cdbs/www-data/pdf/RDA0000/AOA0000C304.pdf; primary_photo: https://media.digikey.com/photos/Panasonic%20Photos/10-0402.jpg; Packaging: Cut Tape (CT); Part Status: Active; Tolerance: ±1%; Composition: Thick Film; Features: Automotive AEC-Q200; Operating Temperature: -55°C ~ 155°C; Package / Case: 0402 (1005 Metric); Ratings: AEC-Q200; Supplier Device Package: 402; Size / Dimension: 0.039" L x 0.020" W (1.00mm x 0.50mm); Height - Seated (Max): 0.016" (0.40mm); Number of Terminations: 2; Failure Rate: -
RN1-RN4 = CMP-05421-000005-1: RES ARRAY 8 RES 100 OHM 1506; Temperature Coefficient: 200ppm/°C; Number of Contacts: 16; Power Per Element: 62.5mW; Power Rating: 250mW; Resistance Tolerance: 5%; Circuit Type: Isolated; Number of Resistors: 8; Voltage Rating: 25V; Power Dissipation: 63mW; Resistance: 100R; Voltage Rating (DC): 50V; Case/Package: 1506; Depth: 1.6mm; Thickness: 450um; Max Operating Temperature: 125°C; Mount: Surface Mount; Case Code (Imperial): 0402; Min Operating Temperature: -55°C; Termination: Convex; Packaging: Tape and Reel; Number of Terminals/Pins: 16; Technology: THICK FILM; Lead Free: Lead Free; Length: 3.8mm; Size Code: 0402; Tolerance: 5%; Number of Pins: 16; Series: EXB; Height: 0.022inch; Width: 0.063inch; Military Standard: Not; Terminal Pitch: 0.5mm; RoHS Compliant: Yes; Radiation Hardening: No; Case Code (Metric): 1005; REACH SVHC: No SVHC; Contact Plating: Tin; Package Quantity: 1; Number of Elements: 8
T1 = HX1198NL: Telecom Transformer 1: 1/1: 1 1500Vrms -1dB Surface Mount; Manufacturer: Pulse; Turns Ratio: 1:1; Shielding: Unshielded; Isolation Voltage: 1.5kV; Return Loss: -12dB; Lead/Base Style: Gull Wing; Supplier 1: Digi-Key; Supplier Part Number 1: 553-1341-ND; RoHS: Yes; Category: Transformers; Mount: Surface Mount; Case/Package: Module; Number of Pins: 16; Min Operating Temperature: -40°C; Max Operating Temperature: 85°C; Package Quantity: 40; Packaging: Rail/Tube; Termination: SMD/SMT; Insertion Loss: -1dB; Series: -; Length: 12.7mm; Width: 9.53m; Height: 5.97mm; Height - Seated (Max): 6.22mm; Depth: 9.53mm; Radiation Hardening: No; RoHS Compliant: Yes; Lead Free: Lead Free; ComponentLink1URL: https://datasheet.ciiva.com/2938/10-100base-tsingleportsmdmagnetics-rev2008-2938766.pdf?src-supplier=Digi-Key; ComponentLink1Description: https://datasheet.ciiva.com/2938/10-100base-tsingleportsmdmagnetics-rev2008-2938766.pdf?src-supplier=Digi-Key; Manufacturer Part Number: HX1198NL
U1 = CMP-57379-000002-1: IC REG BUCK ADJ 500MA TSOT23-6; Manufacturer: Monolithic Power Systems; Max Junction Temp: +125°C; Nominal Supply Current: 0.73mA; Max Duty Cycle: 93.5%; Max Power Dissipation: 0.568W; Standoff Height: 0mm; Max Supply Voltage: 55V; Min Supply Voltage: 4.5V; Number Of Outputs: 1; Output Current: 0.5A; Output Voltage: 0.81-52.25V; Output Type: AdjustableProgrammable; Switching Frequency: 480kHz; RoHS: TRUE; Manufacturer Part Number: MP2459GJ-P; Temperature: -40°C to +125°C; ComponentLink2Description: Datasheet; Automotive: No; Temperature Range High: +125°C; Lead Free: Yes; Octopart: https://octopart.com/mp2459gj-p-monolithic+power+systems-29216401; Device Class L2: Power Management ICs; Digikey Description: IC REG BUCK ADJ 500MA TSOT23-6; Category: IC; Temperature Range Low: -40°C; Height: 1mm; Device Class L3: Voltage Regulators - Switching; Mouser Description: PMIC; DC/DC converter; Uoper: 4.5÷55V; Uout: 0.81÷52.25V; TSOT23-6; Switching Topology: Buck; Package: MP2459GJ-P; Device Class L1: Integrated Circuits (ICs); Ipc Land Pattern Name: SOT95P280X100-6; ComponentLink2URL: https://www.monolithicpower.com/pub/media/document/MP2459_r1.01.pdf
U2 = Teensy 4.1: Teensy 4.1 Development Board; Manufacturer: SparkFun; Manufacturer Part Number: DEV-16771; Supplier 1: Digi-Key; Supplier Part Number 1: 1568-DEV-16771-ND; RoHS: No; Category: Embedded Processors and Controllers; Stock 1: 198; Pricing 1: 1=29.38000 (USD)
U3-U5 = 140357145400: Optocoupler, Transistor, 35V, Sop-4 Rohs Compliant: Yes; Manufacturer: Wurth Electronics; Supplier 1: Digi-Key; Supplier Part Number 1: 732-140357145400CT-ND; RoHS: Yes; Category: Optocouplers; Stock 1: 6279; Pricing 1: 1=0.29000, 10=0.25200, 50=0.23300, 100=0.21100, 500=0.19100 (USD); Manufacturer Part Number: 140357145400
U6 = CMP-04874-000003-1: IC POE CNTRL 1 CHANNEL 20VQFN; Operating Supply Current: 550uA; Max Power Dissipation: 90W; Number of Channels: 1; Max Operating Temperature: 125°C; RoHS Compliant: Yes; Packaging: Tape and Reel; Case/Package: VQFN; Min Operating Temperature: -40°C
U7 U8 = CMP-07121-000003-1: GREENBRIDGETM 2 SERIES OF HIGH-E; Manufacturer: ON Semiconductor; Max Junction Temp: +125°C; Number Of Outputs: 2; Standoff Height: 0mm; Nominal Supply Current: 5-3200uA; Max Supply Voltage: 57V; Max Power Dissipation: 0.78W; Manufacturer Part Number: FDMQ8205A; Octopart: https://octopart.com/fdmq8205a-on+semiconductor-84326195; Height: 0.8mm; Lead Free: Yes; Temperature Range High: +125°C; Category: IC; Device Class L1: Integrated Circuits (ICs); Device Class L2: Power Management ICs; Automotive: No; Temperature: -40°C to +125°C; ComponentLink2URL: https://www.onsemi.com/pub/Collateral/FDMQ8205A-D.pdf; Temperature Range Low: -40°C; Digikey Description: GREENBRIDGETM 2 SERIES OF HIGH-E; Device Class L3: unset; Package: 511CS; RoHS: TRUE; Ambient Temperature Range Low: -40°C; Footprint Url: https://www.onsemi.com/pub/Collateral/511CS.PDF; ComponentLink2Description: Datasheet; Output Voltage: 57V; Ambient Temperature Range High: +85°C
U9-U12 = CMP-0807-00199-3: 8-Bit Shift Registers With 3-State Output Registers, PW0016A, LARGE T&R; Manufacturer: Texas Instruments; F @ Nom Voltage(Max)(Mhz): 70; Bits: 8; Output Drive (IOL/IOH)(Max)(mA): 8/-8; Technology Family: AHCT; ICC @ Nom Voltage(Max)(mA): 0.04; 3-State Output: Yes; VCC(Max)(V): 5.5; Voltage(Nom)(V): 5; VCC(Min)(V): 4.5; Output Type: CMOS; Rating: Catalog; Input Type: TTL; tpd @ Nom Voltage(Max)(ns): 11.4; PackageVersion: http://www.ti.com/lit/ml/mpds361/mpds361.pdf; PackageReference: PW0016A; Code_JEDEC: MO-153; Operating Temperature Range(C): -40 to 85; DatasheetVersion: SCLS374N; Generic Part Number: SN74AHCT595